# Altium project pi_clock.PrjPcb
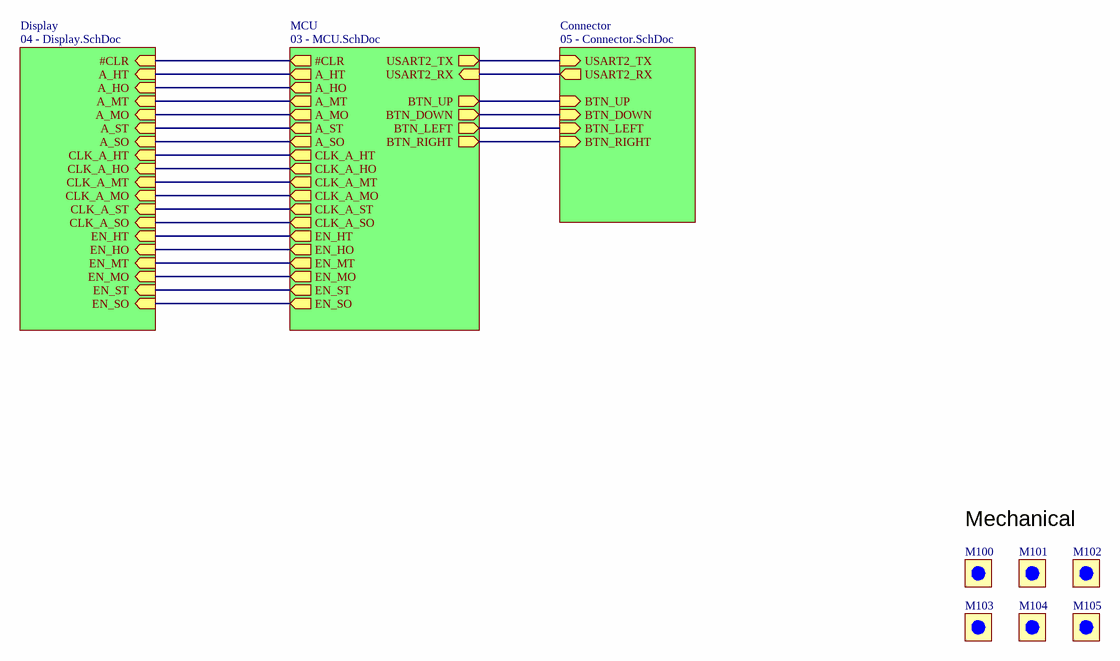
[diagram p0: 01 - Overview.SchDoc]
Reviewer: ____; ProjectState: Prototype/Release/Series; ProjectRevision: 2; ProjectNumberMiromico: UE; ProductName: ____; PCBNumberMiromico: pi_clock; PCBName: PCBName?; MFGApprovedDate: dd.mm.yyyy; DrawDate: dd.mm.yyyy; Customer: ____; CoAuthorMiromico: ____; CheckedDate: dd.mm.yyyy; CheckedByMiromico: ____; BoardRevision: B; AuthorMiromico: ____; ApprovedDate: dd.mm.yyyy
4 sheets, 125 parts. Net scope: hierarchical (ports join the sheet entries above them; power ports are global).
Board file: pi_clock.PcbDoc
Sheets:
  01 - Overview.SchDoc
    Display = 04 - Display.SchDoc
    MCU = 03 - MCU.SchDoc
    Connector = 05 - Connector.SchDoc

## Sheet 01 - Overview.SchDoc
size A4; SheetNumber: 1; SheetTotal: 4; SchemaTitle: Overview

### Parts
M100  Fiducial Round  [Fiducial round_small]  (value not drawn)  (no BOM)
M101  Fiducial Round  [Fiducial round_small]  (value not drawn)  (no BOM)
M102  Fiducial Round  [Fiducial round_small]  (value not drawn)  (no BOM)
M103  Fiducial Round  [Fiducial round_small]  (value not drawn)  (no BOM)
M104  Fiducial Round  [Fiducial round_small]  (value not drawn)  (no BOM)
M105  Fiducial Round  [Fiducial round_small]  (value not drawn)  (no BOM)

### Sub-sheets
Connector = 05 - Connector.SchDoc: USART2_RX (out), USART2_TX (in), BTN_UP (in), BTN_DOWN (in), BTN_LEFT (in), BTN_RIGHT (in)
Display = 04 - Display.SchDoc: #CLR (in), A_HT (in), A_HO (in), A_MO (in), A_SO (in), A_MT (in), A_ST (in), CLK_A_HT (in), CLK_A_HO (in), CLK_A_MT (in), CLK_A_MO (in), CLK_A_ST (in), CLK_A_SO (in), EN_HT (in), EN_HO (in), EN_MT (in), EN_MO (in), EN_ST (in), EN_SO (in)
MCU = 03 - MCU.SchDoc: #CLR (out), A_HT (out), A_HO (out), A_MT (out), A_MO (out), A_ST (out), A_SO (out), USART2_TX (out), USART2_RX (in), BTN_UP (out), BTN_DOWN (out), BTN_LEFT (out), BTN_RIGHT (out), CLK_A_HT (out), CLK_A_HO (out), CLK_A_MT (out), CLK_A_MO (out), CLK_A_ST (out), CLK_A_SO (out), EN_HT (out), EN_HO (out), EN_MT (out), EN_MO (out), EN_ST (out), EN_SO (out)

### Nets
#CLR: sheet Display/#CLR, sheet MCU/#CLR
A_HO: sheet Display/A_HO, sheet MCU/A_HO
A_HT: sheet Display/A_HT, sheet MCU/A_HT
A_MO: sheet Display/A_MO, sheet MCU/A_MO
A_MT: sheet Display/A_MT, sheet MCU/A_MT
A_SO: sheet Display/A_SO, sheet MCU/A_SO
A_ST: sheet Display/A_ST, sheet MCU/A_ST
BTN_DOWN: sheet MCU/BTN_DOWN, sheet Connector/BTN_DOWN
BTN_LEFT: sheet MCU/BTN_LEFT, sheet Connector/BTN_LEFT
BTN_RIGHT: sheet MCU/BTN_RIGHT, sheet Connector/BTN_RIGHT
BTN_UP: sheet MCU/BTN_UP, sheet Connector/BTN_UP
CLK_A_HO: sheet Display/CLK_A_HO, sheet MCU/CLK_A_HO
CLK_A_HT: sheet Display/CLK_A_HT, sheet MCU/CLK_A_HT
CLK_A_MO: sheet Display/CLK_A_MO, sheet MCU/CLK_A_MO
CLK_A_MT: sheet Display/CLK_A_MT, sheet MCU/CLK_A_MT
CLK_A_SO: sheet Display/CLK_A_SO, sheet MCU/CLK_A_SO
CLK_A_ST: sheet Display/CLK_A_ST, sheet MCU/CLK_A_ST
EN_HO: sheet Display/EN_HO, sheet MCU/EN_HO
EN_HT: sheet Display/EN_HT, sheet MCU/EN_HT
EN_MO: sheet Display/EN_MO, sheet MCU/EN_MO
EN_MT: sheet Display/EN_MT, sheet MCU/EN_MT
EN_SO: sheet Display/EN_SO, sheet MCU/EN_SO
EN_ST: sheet Display/EN_ST, sheet MCU/EN_ST
USART2_RX: sheet MCU/USART2_RX, sheet Connector/USART2_RX
USART2_TX: sheet MCU/USART2_TX, sheet Connector/USART2_TX

### Notes on the sheet
- Mechanical
- Schema Title:
- Project:
- Revision:
- Author:
- PCB Name:
- Date:
- Time:
- Sheet:
- of
- Doc Name:
- A4

### Library data of the parts
M100-M105 = Fiducial Round-11: Fiducial (Optical Marker)

## Sheet 04 - Display.SchDoc
size A4; SheetNumber: 3; SheetTotal: 4; SchemaTitle: Overview
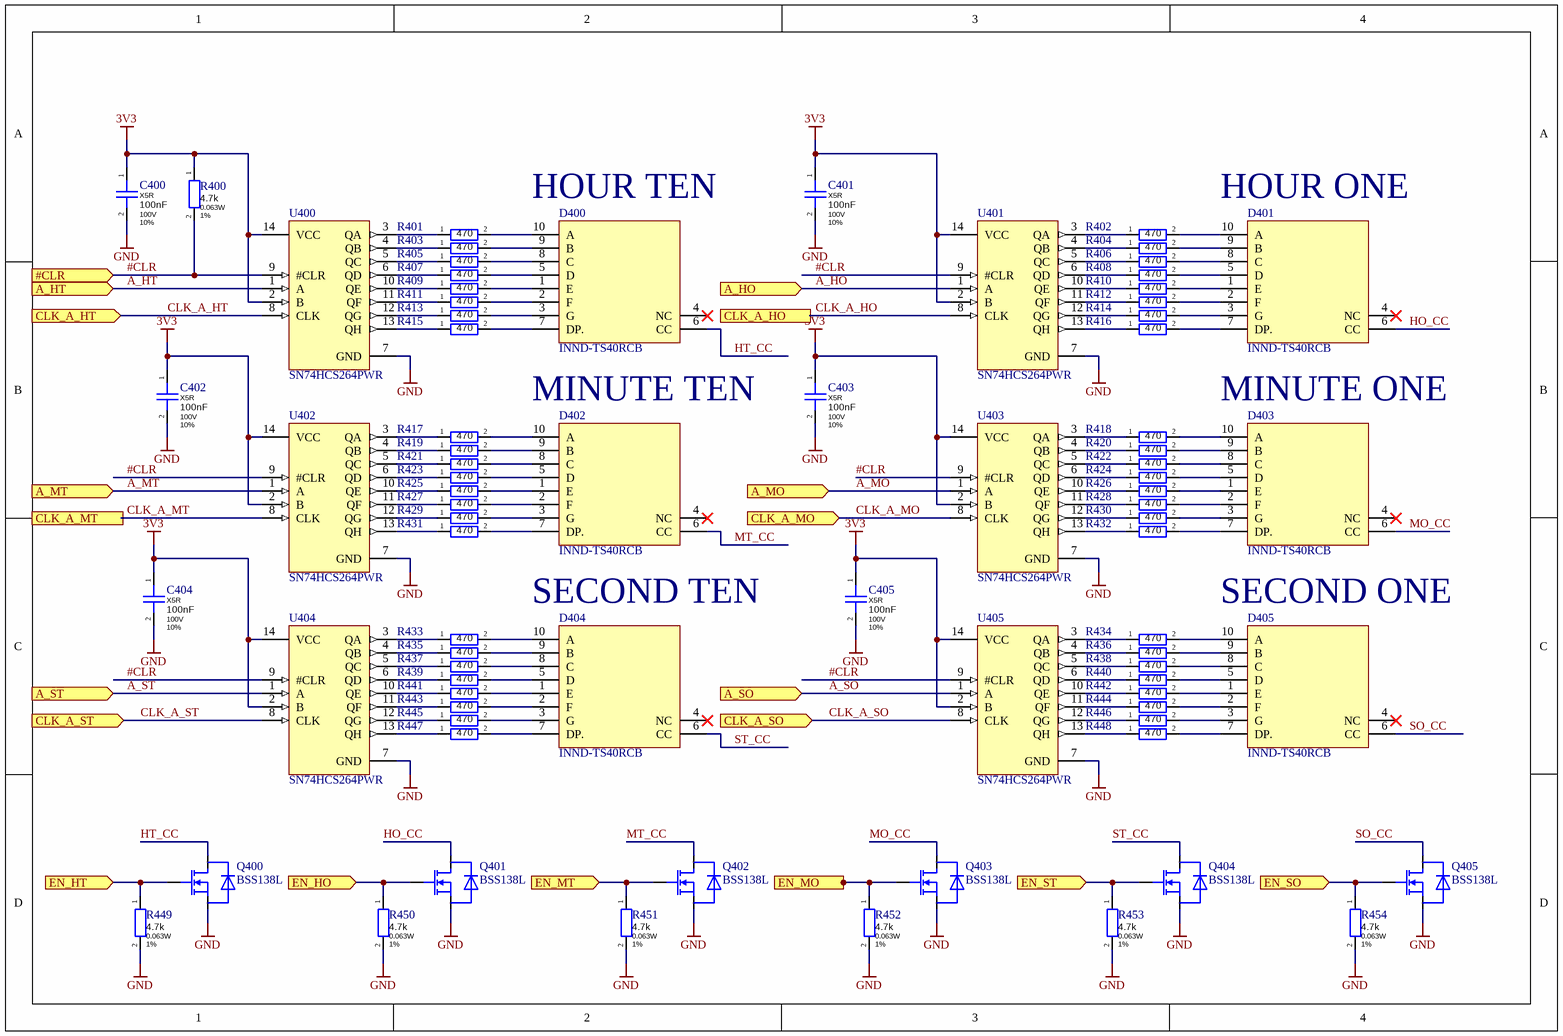
[diagram p1: 04 - Display.SchDoc]

### Parts
C400  Dielectric: X5R  Capacitance: 100nF  Voltage Rating: 100V  Tolerance: 10%  [CAPC0402(1005)60_L]  (hidden comment: GRM155R62A104KE14D)
C401  Dielectric: X5R  Capacitance: 100nF  Voltage Rating: 100V  Tolerance: 10%  [CAPC0402(1005)60_L]  (hidden comment: GRM155R62A104KE14D)
C402  Dielectric: X5R  Capacitance: 100nF  Voltage Rating: 100V  Tolerance: 10%  [CAPC0402(1005)60_L]  (hidden comment: GRM155R62A104KE14D)
C403  Dielectric: X5R  Capacitance: 100nF  Voltage Rating: 100V  Tolerance: 10%  [CAPC0402(1005)60_L]  (hidden comment: GRM155R62A104KE14D)
C404  Dielectric: X5R  Capacitance: 100nF  Voltage Rating: 100V  Tolerance: 10%  [CAPC0402(1005)60_L]  (hidden comment: GRM155R62A104KE14D)
C405  Dielectric: X5R  Capacitance: 100nF  Voltage Rating: 100V  Tolerance: 10%  [CAPC0402(1005)60_L]  (hidden comment: GRM155R62A104KE14D)
D400  INND-TS40RCB  [INND-TS40RCB-Footprint-1]
D401  INND-TS40RCB  [INND-TS40RCB-Footprint-1]
D402  INND-TS40RCB  [INND-TS40RCB-Footprint-1]
D403  INND-TS40RCB  [INND-TS40RCB-Footprint-1]
D404  INND-TS40RCB  [INND-TS40RCB-Footprint-1]
D405  INND-TS40RCB  [INND-TS40RCB-Footprint-1]
Q400  BSS138L  [SOT23-3]
Q401  BSS138L  [SOT23-3]
Q402  BSS138L  [SOT23-3]
Q403  BSS138L  [SOT23-3]
Q404  BSS138L  [SOT23-3]
Q405  BSS138L  [SOT23-3]
R400  Resistance: 4.7k  Power Rating: 0.063W  Tolerance: 1%  [RESC0402(1005)_L]  (hidden comment: RMCF0402FT4K70)
R401  Resistance: 470  [RESC0402(1005)_L]  (hidden comment: RMCF0402FT470R)
R402  Resistance: 470  [RESC0402(1005)_L]  (hidden comment: RMCF0402FT470R)
R403  Resistance: 470  [RESC0402(1005)_L]  (hidden comment: RMCF0402FT470R)
R404  Resistance: 470  [RESC0402(1005)_L]  (hidden comment: RMCF0402FT470R)
R405  Resistance: 470  [RESC0402(1005)_L]  (hidden comment: RMCF0402FT470R)
R406  Resistance: 470  [RESC0402(1005)_L]  (hidden comment: RMCF0402FT470R)
R407  Resistance: 470  [RESC0402(1005)_L]  (hidden comment: RMCF0402FT470R)
R408  Resistance: 470  [RESC0402(1005)_L]  (hidden comment: RMCF0402FT470R)
R409  Resistance: 470  [RESC0402(1005)_L]  (hidden comment: RMCF0402FT470R)
R410  Resistance: 470  [RESC0402(1005)_L]  (hidden comment: RMCF0402FT470R)
R411  Resistance: 470  [RESC0402(1005)_L]  (hidden comment: RMCF0402FT470R)
R412  Resistance: 470  [RESC0402(1005)_L]  (hidden comment: RMCF0402FT470R)
R413  Resistance: 470  [RESC0402(1005)_L]  (hidden comment: RMCF0402FT470R)
R414  Resistance: 470  [RESC0402(1005)_L]  (hidden comment: RMCF0402FT470R)
R415  Resistance: 470  [RESC0402(1005)_L]  (hidden comment: RMCF0402FT470R)
R416  Resistance: 470  [RESC0402(1005)_L]  (hidden comment: RMCF0402FT470R)
R417  Resistance: 470  [RESC0402(1005)_L]  (hidden comment: RMCF0402FT470R)
R418  Resistance: 470  [RESC0402(1005)_L]  (hidden comment: RMCF0402FT470R)
R419  Resistance: 470  [RESC0402(1005)_L]  (hidden comment: RMCF0402FT470R)
R420  Resistance: 470  [RESC0402(1005)_L]  (hidden comment: RMCF0402FT470R)
R421  Resistance: 470  [RESC0402(1005)_L]  (hidden comment: RMCF0402FT470R)
R422  Resistance: 470  [RESC0402(1005)_L]  (hidden comment: RMCF0402FT470R)
R423  Resistance: 470  [RESC0402(1005)_L]  (hidden comment: RMCF0402FT470R)
R424  Resistance: 470  [RESC0402(1005)_L]  (hidden comment: RMCF0402FT470R)
R425  Resistance: 470  [RESC0402(1005)_L]  (hidden comment: RMCF0402FT470R)
R426  Resistance: 470  [RESC0402(1005)_L]  (hidden comment: RMCF0402FT470R)
R427  Resistance: 470  [RESC0402(1005)_L]  (hidden comment: RMCF0402FT470R)
R428  Resistance: 470  [RESC0402(1005)_L]  (hidden comment: RMCF0402FT470R)
R429  Resistance: 470  [RESC0402(1005)_L]  (hidden comment: RMCF0402FT470R)
R430  Resistance: 470  [RESC0402(1005)_L]  (hidden comment: RMCF0402FT470R)
R431  Resistance: 470  [RESC0402(1005)_L]  (hidden comment: RMCF0402FT470R)
R432  Resistance: 470  [RESC0402(1005)_L]  (hidden comment: RMCF0402FT470R)
R433  Resistance: 470  [RESC0402(1005)_L]  (hidden comment: RMCF0402FT470R)
R434  Resistance: 470  [RESC0402(1005)_L]  (hidden comment: RMCF0402FT470R)
R435  Resistance: 470  [RESC0402(1005)_L]  (hidden comment: RMCF0402FT470R)
R436  Resistance: 470  [RESC0402(1005)_L]  (hidden comment: RMCF0402FT470R)
R437  Resistance: 470  [RESC0402(1005)_L]  (hidden comment: RMCF0402FT470R)
R438  Resistance: 470  [RESC0402(1005)_L]  (hidden comment: RMCF0402FT470R)
R439  Resistance: 470  [RESC0402(1005)_L]  (hidden comment: RMCF0402FT470R)
R440  Resistance: 470  [RESC0402(1005)_L]  (hidden comment: RMCF0402FT470R)
R441  Resistance: 470  [RESC0402(1005)_L]  (hidden comment: RMCF0402FT470R)
R442  Resistance: 470  [RESC0402(1005)_L]  (hidden comment: RMCF0402FT470R)
R443  Resistance: 470  [RESC0402(1005)_L]  (hidden comment: RMCF0402FT470R)
R444  Resistance: 470  [RESC0402(1005)_L]  (hidden comment: RMCF0402FT470R)
R445  Resistance: 470  [RESC0402(1005)_L]  (hidden comment: RMCF0402FT470R)
R446  Resistance: 470  [RESC0402(1005)_L]  (hidden comment: RMCF0402FT470R)
R447  Resistance: 470  [RESC0402(1005)_L]  (hidden comment: RMCF0402FT470R)
R448  Resistance: 470  [RESC0402(1005)_L]  (hidden comment: RMCF0402FT470R)
R449  Resistance: 4.7k  Power Rating: 0.063W  Tolerance: 1%  [RESC0402(1005)_L]  (hidden comment: RMCF0402FT4K70)
R450  Resistance: 4.7k  Power Rating: 0.063W  Tolerance: 1%  [RESC0402(1005)_L]  (hidden comment: RMCF0402FT4K70)
R451  Resistance: 4.7k  Power Rating: 0.063W  Tolerance: 1%  [RESC0402(1005)_L]  (hidden comment: RMCF0402FT4K70)
R452  Resistance: 4.7k  Power Rating: 0.063W  Tolerance: 1%  [RESC0402(1005)_L]  (hidden comment: RMCF0402FT4K70)
R453  Resistance: 4.7k  Power Rating: 0.063W  Tolerance: 1%  [RESC0402(1005)_L]  (hidden comment: RMCF0402FT4K70)
R454  Resistance: 4.7k  Power Rating: 0.063W  Tolerance: 1%  [RESC0402(1005)_L]  (hidden comment: RMCF0402FT4K70)
U400  SN74HCS264PWR  [TSSOP-14]
U401  SN74HCS264PWR  [TSSOP-14]
U402  SN74HCS264PWR  [TSSOP-14]
U403  SN74HCS264PWR  [TSSOP-14]
U404  SN74HCS264PWR  [TSSOP-14]
U405  SN74HCS264PWR  [TSSOP-14]

### Ports
#CLR (in), A_HO (in), A_HT (in), A_MO (in), A_MT (in), A_SO (in), A_ST (in), CLK_A_HO (in), CLK_A_HT (in), CLK_A_MO (in), CLK_A_MT (in), CLK_A_SO (in), CLK_A_ST (in), EN_HO (in), EN_HT (in), EN_MO (in), EN_MT (in), EN_SO (in), EN_ST (in)

### Nets
3V3: C400.1 C401.1 C402.1 C403.1 C404.1 C405.1 R400.1 U400.2(B) U400.14(VCC) U401.2(B) U401.14(VCC) U402.2(B) U402.14(VCC) U403.2(B) U403.14(VCC) U404.2(B) U404.14(VCC) U405.2(B) U405.14(VCC)
GND: C400.2 C401.2 C402.2 C403.2 C404.2 C405.2 Q400.2(S) Q401.2(S) Q402.2(S) Q403.2(S) Q404.2(S) Q405.2(S) R449.2 R450.2 R451.2 R452.2 R453.2 R454.2 U400.7(GND) U401.7(GND) U402.7(GND) U403.7(GND) U404.7(GND) U405.7(GND)
#CLR: R400.2 U400.9(#CLR) U401.9(#CLR) U402.9(#CLR) U403.9(#CLR) U404.9(#CLR) U405.9(#CLR) ; port #CLR
A_HO: U401.1(A) ; port A_HO
A_HT: U400.1(A) ; port A_HT
A_MO: U403.1(A) ; port A_MO
A_MT: U402.1(A) ; port A_MT
A_SO: U405.1(A) ; port A_SO
A_ST: U404.1(A) ; port A_ST
CLK_A_HO: U401.8(CLK) ; port CLK_A_HO
CLK_A_HT: U400.8(CLK) ; port CLK_A_HT
CLK_A_MO: U403.8(CLK) ; port CLK_A_MO
CLK_A_MT: U402.8(CLK) ; port CLK_A_MT
CLK_A_SO: U405.8(CLK) ; port CLK_A_SO
CLK_A_ST: U404.8(CLK) ; port CLK_A_ST
EN_HO: Q401.1(G) R450.1 ; port EN_HO
EN_HT: Q400.1(G) R449.1 ; port EN_HT
EN_MO: Q403.1(G) R452.1 ; port EN_MO
EN_MT: Q402.1(G) R451.1 ; port EN_MT
EN_SO: Q405.1(G) R454.1 ; port EN_SO
EN_ST: Q404.1(G) R453.1 ; port EN_ST
HO_CC: D401.6(CC) Q401.3(D)
HT_CC: D400.6(CC) Q400.3(D)
MO_CC: D403.6(CC) Q403.3(D)
MT_CC: D402.6(CC) Q402.3(D)
SO_CC: D405.6(CC) Q405.3(D)
ST_CC: D404.6(CC) Q404.3(D)
NetD400_1: D400.1(E) R409.2
NetD400_2: D400.2(F) R411.2
NetD400_3: D400.3(G) R413.2
NetD400_5: D400.5(D) R407.2
NetD400_7: D400.7(DP.) R415.2
NetD400_8: D400.8(C) R405.2
NetD400_9: D400.9(B) R403.2
NetD400_10: D400.10(A) R401.2
NetD401_1: D401.1(E) R410.2
NetD401_2: D401.2(F) R412.2
NetD401_3: D401.3(G) R414.2
NetD401_5: D401.5(D) R408.2
NetD401_7: D401.7(DP.) R416.2
NetD401_8: D401.8(C) R406.2
NetD401_9: D401.9(B) R404.2
NetD401_10: D401.10(A) R402.2
NetD402_1: D402.1(E) R425.2
NetD402_2: D402.2(F) R427.2
NetD402_3: D402.3(G) R429.2
NetD402_5: D402.5(D) R423.2
NetD402_7: D402.7(DP.) R431.2
NetD402_8: D402.8(C) R421.2
NetD402_9: D402.9(B) R419.2
NetD402_10: D402.10(A) R417.2
NetD403_1: D403.1(E) R426.2
NetD403_2: D403.2(F) R428.2
NetD403_3: D403.3(G) R430.2
NetD403_5: D403.5(D) R424.2
NetD403_7: D403.7(DP.) R432.2
NetD403_8: D403.8(C) R422.2
NetD403_9: D403.9(B) R420.2
NetD403_10: D403.10(A) R418.2
NetD404_1: D404.1(E) R441.2
NetD404_2: D404.2(F) R443.2
NetD404_3: D404.3(G) R445.2
NetD404_5: D404.5(D) R439.2
NetD404_7: D404.7(DP.) R447.2
NetD404_8: D404.8(C) R437.2
NetD404_9: D404.9(B) R435.2
NetD404_10: D404.10(A) R433.2
NetD405_1: D405.1(E) R442.2
NetD405_2: D405.2(F) R444.2
NetD405_3: D405.3(G) R446.2
NetD405_5: D405.5(D) R440.2
NetD405_7: D405.7(DP.) R448.2
NetD405_8: D405.8(C) R438.2
NetD405_9: D405.9(B) R436.2
NetD405_10: D405.10(A) R434.2
NetR401_1: R401.1 U400.3(QA)
NetR402_1: R402.1 U401.3(QA)
NetR403_1: R403.1 U400.4(QB)
NetR404_1: R404.1 U401.4(QB)
NetR405_1: R405.1 U400.5(QC)
NetR406_1: R406.1 U401.5(QC)
NetR407_1: R407.1 U400.6(QD)
NetR408_1: R408.1 U401.6(QD)
NetR409_1: R409.1 U400.10(QE)
NetR410_1: R410.1 U401.10(QE)
NetR411_1: R411.1 U400.11(QF)
NetR412_1: R412.1 U401.11(QF)
NetR413_1: R413.1 U400.12(QG)
NetR414_1: R414.1 U401.12(QG)
NetR415_1: R415.1 U400.13(QH)
NetR416_1: R416.1 U401.13(QH)
NetR417_1: R417.1 U402.3(QA)
NetR418_1: R418.1 U403.3(QA)
NetR419_1: R419.1 U402.4(QB)
NetR420_1: R420.1 U403.4(QB)
NetR421_1: R421.1 U402.5(QC)
NetR422_1: R422.1 U403.5(QC)
NetR423_1: R423.1 U402.6(QD)
NetR424_1: R424.1 U403.6(QD)
NetR425_1: R425.1 U402.10(QE)
NetR426_1: R426.1 U403.10(QE)
NetR427_1: R427.1 U402.11(QF)
NetR428_1: R428.1 U403.11(QF)
NetR429_1: R429.1 U402.12(QG)
NetR430_1: R430.1 U403.12(QG)
NetR431_1: R431.1 U402.13(QH)
NetR432_1: R432.1 U403.13(QH)
NetR433_1: R433.1 U404.3(QA)
NetR434_1: R434.1 U405.3(QA)
NetR435_1: R435.1 U404.4(QB)
NetR436_1: R436.1 U405.4(QB)
NetR437_1: R437.1 U404.5(QC)
NetR438_1: R438.1 U405.5(QC)
NetR439_1: R439.1 U404.6(QD)
NetR440_1: R440.1 U405.6(QD)
NetR441_1: R441.1 U404.10(QE)
NetR442_1: R442.1 U405.10(QE)
NetR443_1: R443.1 U404.11(QF)
NetR444_1: R444.1 U405.11(QF)
NetR445_1: R445.1 U404.12(QG)
NetR446_1: R446.1 U405.12(QG)
NetR447_1: R447.1 U404.13(QH)
NetR448_1: R448.1 U405.13(QH)

Not connected (* = marked no-connect by the designer): D400 4(NC)*; D401 4(NC)*; D402 4(NC)*; D403 4(NC)*; D404 4(NC)*; D405 4(NC)*

### Notes on the sheet
- (near D400) HOUR TEN
- (near D401) HOUR ONE
- MINUTE TEN
- MINUTE ONE
- SECOND TEN
- SECOND ONE
- Schema Title:
- Project:
- Revision:
- Author:
- PCB Name:
- Date:
- Time:
- Sheet:
- of
- Doc Name:
- A4

### Library data of the parts
C400-C405 = CMP-00636-01: 0.1µF ±10% 100V Ceramic Capacitor X5R 0402 (1005 Metric); Manufacturer: Murata Electronics; RoHS Compliant: Yes; Mount: Surface Mount; Max Operating Temperature: 85°C; Min Operating Temperature: -55°C; Supplier Part Number 1: 490-10458-1-ND; Case/Package: 0402; Length: 0.039inch; Manufacturer Part Number: GRM155R62A104KE14D; Termination: SMD/SMT; Thickness: 0.022inch; ComponentLink1Description: Datasheet; Packaging: Tape and Reel; Height: 0.5mm; Package Quantity: 10000; Supplier 1: Digi-Key; Case Code (Imperial): 0402; Lead Free: Lead Free; Case Code (Metric): 1005; Voltage Rating (DC): 100V; Width: 0.5mm; Weight: 0.000212oz; REACH SVHC: No SVHC
D400-D405 = CMP-02011-01: Display Modules - LED Character and Numeric Red 7-Segment 1 Character Common Cathode 2V 20mA 0.508" H x 0.379" W x 0.250" D (12.90mm x 9.63mm x 6.36mm) 10-DIP (0.300", 7.62mm); Manufacturer: Inolux; ComponentLink1URL: https://www.inolux-corp.com/datasheet/Display/Through-Hole-Display/SingleDigit/INND-TS40%20Series_V1.0.pdf; Supplier Part Number 1: 1830-1155-ND; Supplier 1: Digi-Key; Manufacturer Part Number: INND-TS40RCB; ComponentLink1Description: Datasheet
Q400-Q405 = CMP-00239-05: MOSFET N-CH 50V 200MA SOT-23; Manufacturer: ON Semiconductor; Turn-On Delay Time: 2.2ns; Input Capacitance: 50pF; Max Power Dissipation: 350mW; Gate to Source Voltage (Vgs): 20V; Fall Time: 5.1ns; Rise Time: 1.8ns; Drain to Source Resistance: 3.5R; Element Configuration: Single; Number of Channels: 1; Turn-Off Delay Time: 5.3ns; Threshold Voltage: 1.25V; Drain to Source Breakdown Voltage: 50V; Package Quantity: 3000; Manufacturer Part Number: BSS138L; ComponentLink1URL: https://www.onsemi.com/pdf/datasheet/bss138l-d.pdf; Min Operating Temperature: -55°C; Continuous Drain Current (ID): 200mA; Supplier Part Number 1: BSS138LCT-ND; ComponentLink1Description: Datasheet; Weight: 0.03g; Supplier 1: Digikey; REACH SVHC: No SVHC; Case/Package: SOT-23-3; Drain to Source Voltage (Vdss): 50V; Packaging: Tape and Reel; Rds On Max: 3.5R; Max Operating Temperature: 150°C; Mount: Surface Mount; Number of Pins: 3
R400 R449-R454 = CMP-00490-01: 4.7 kOhms ±1% 0.063W, 1/16W Chip Resistor 0402 (1005 Metric) Automotive AEC-Q200 Thick Film; Manufacturer: Stackpole Electronics Inc; Max Power Dissipation: 63mW; Temperature Coefficient: 100ppm/°C; Case Code (Metric): 1005; Case Code (Imperial): 0402; Min Operating Temperature: -55°C; Supplier Part Number 1: RMCF0402FT4K70CT-ND; Radiation Hardening: No; Width: 0.02inch; Depth: 0.5mm; Supplier 1: Digi-Key; Case/Package: 0402; Length: 1mm; Lead Free: Lead Free; Height: 0.016inch; Max Operating Temperature: 155°C; Features: Automotive AEC-Q200; Number of Terminations: 2; Resistor Type: Thick Film; Contact Plating: Tin,Matte; Military Standard: Not; Manufacturer Part Number: RMCF0402FT4K70; Mount: Surface Mount; Packaging: Tape and Reel; ComponentLink1Description: Datasheet
R401-R448 = CMP-00454-01: 470 Ohms ±1% 0.063W, 1/16W Chip Resistor 0402 (1005 Metric) Automotive AEC-Q200 Thick Film; Manufacturer: Stackpole Electronics Inc; Power Rating: 63mW; Temperature Coefficient: 100ppm/°C; Tolerance: 1%; Resistor Type: Thick Film; Packaging: Tape and Reel; Max Operating Temperature: 155°C; Height: 0.016inch; Manufacturer Part Number: RMCF0402FT470R; Radiation Hardening: No; Number of Terminations: 2; Contact Plating: Tin,Matte; Case Code (Metric): 1005; Case/Package: 0402; ComponentLink1Description: Datasheet; Supplier Part Number 1: 738-RMCF0402FT470RCT-ND; Supplier 1: Digi-Key; Length: 0.039inch; Mount: Surface Mount; Case Code (Imperial): 0402; Features: Automotive AEC-Q200; Width: 0.02inch; Max Power Dissipation: 63mW; Min Operating Temperature: -55°C
U400-U405 = CMP-02018-01: Shift Shift Register 1 Element 8 Bit 14-TSSOP; Manufacturer: Texas Instruments; ComponentLink1Description: Datasheet; Supplier 1: Digi-Key; Supplier Part Number 1: 296-SN74HCS264PWRCT-ND; ComponentLink1URL: https://www.ti.com/lit/ds/symlink/sn74hcs264.pdf; Manufacturer Part Number: SN74HCS264PWR

## Sheet 03 - MCU.SchDoc
size A4; SheetNumber: 2; SheetTotal: 4; SchemaTitle: Overview
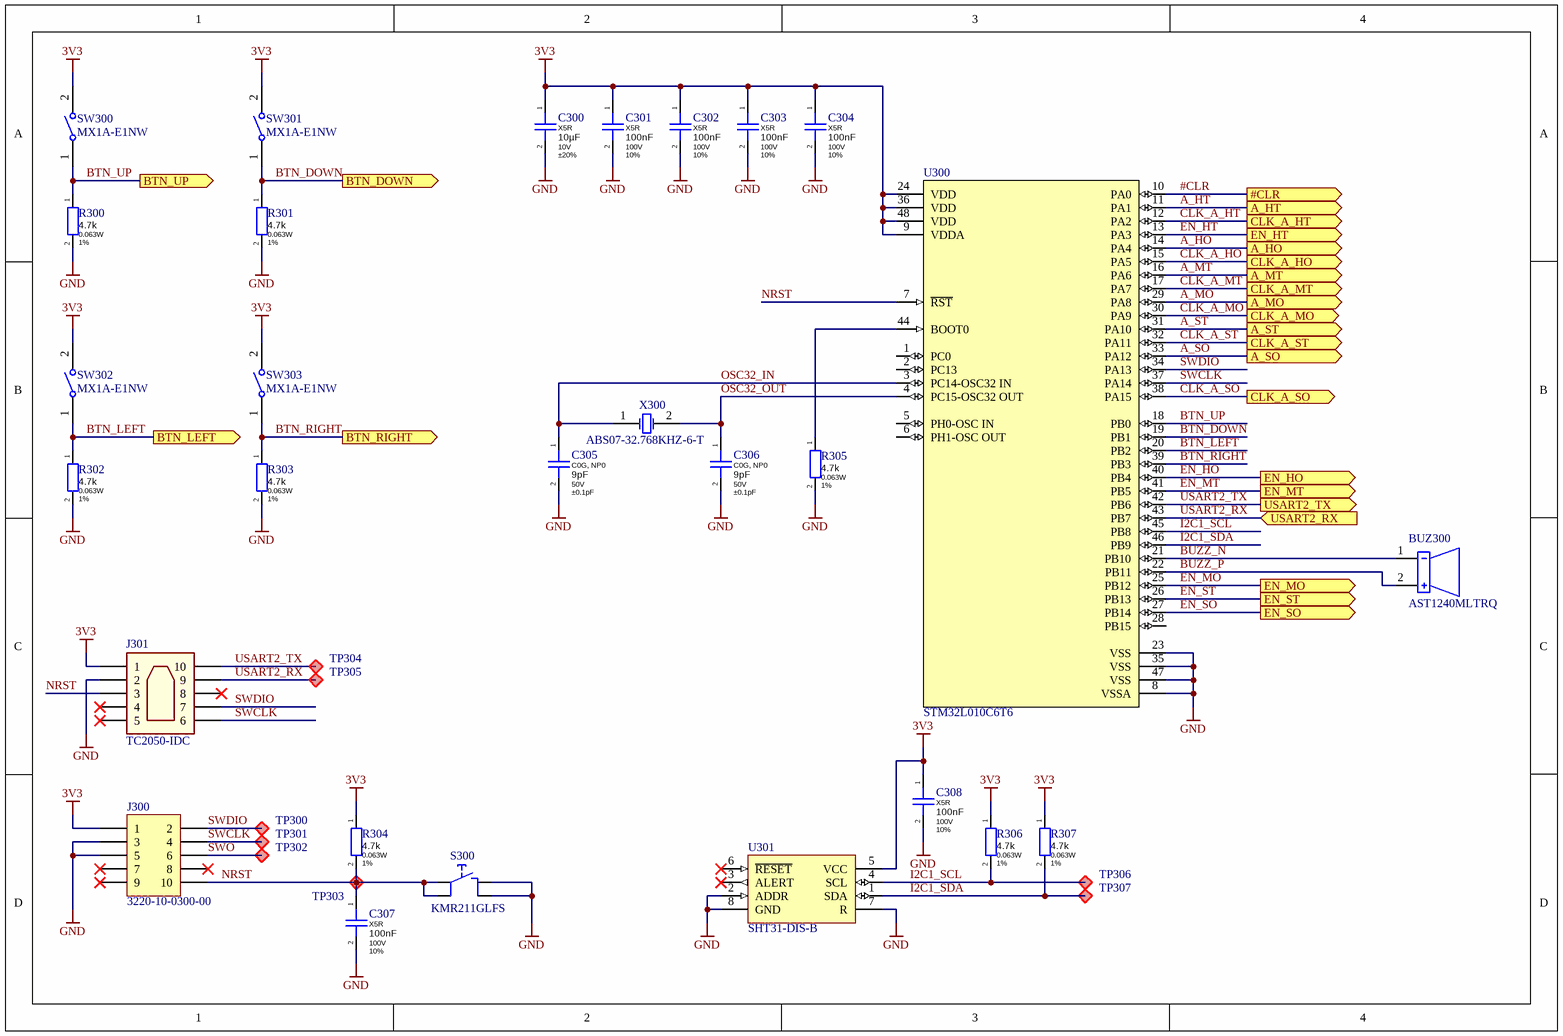
[diagram p2: 03 - MCU.SchDoc]

### Parts
BUZ300  AST1240MLTRQ  [AST1240MLTRQ]
C300  Dielectric: X5R  Capacitance: 10µF  Voltage Rating: 10V  Tolerance: ±20%  [CAPC0402(1005)60_L]  (hidden comment: CL05A106MP8NUB8)
C301  Dielectric: X5R  Capacitance: 100nF  Voltage Rating: 100V  Tolerance: 10%  [CAPC0402(1005)60_L]  (hidden comment: GRM155R62A104KE14D)
C302  Dielectric: X5R  Capacitance: 100nF  Voltage Rating: 100V  Tolerance: 10%  [CAPC0402(1005)60_L]  (hidden comment: GRM155R62A104KE14D)
C303  Dielectric: X5R  Capacitance: 100nF  Voltage Rating: 100V  Tolerance: 10%  [CAPC0402(1005)60_L]  (hidden comment: GRM155R62A104KE14D)
C304  Dielectric: X5R  Capacitance: 100nF  Voltage Rating: 100V  Tolerance: 10%  [CAPC0402(1005)60_L]  (hidden comment: GRM155R62A104KE14D)
C305  Dielectric: C0G, NP0  Capacitance: 9pF  Voltage Rating: 50V  Tolerance: ±0.1pF  [CAPC0402(1005)60_L]  (hidden comment: CC0402BRNPO9BN9R0)
C306  Dielectric: C0G, NP0  Capacitance: 9pF  Voltage Rating: 50V  Tolerance: ±0.1pF  [CAPC0402(1005)60_L]  (hidden comment: CC0402BRNPO9BN9R0)
C307  Dielectric: X5R  Capacitance: 100nF  Voltage Rating: 100V  Tolerance: 10%  [CAPC0402(1005)60_L]  (hidden comment: GRM155R62A104KE14D)
C308  Dielectric: X5R  Capacitance: 100nF  Voltage Rating: 100V  Tolerance: 10%  [CAPC0402(1005)60_L]  (hidden comment: GRM155R62A104KE14D)
J300  3220-10-0300-00  [3220-10-0300-00-Footprint-1]
J301  TC2050-IDC  [TC2050-IDC]  (no BOM)
R300  Resistance: 4.7k  Power Rating: 0.063W  Tolerance: 1%  [RESC0402(1005)_L]  (hidden comment: RMCF0402FT4K70)
R301  Resistance: 4.7k  Power Rating: 0.063W  Tolerance: 1%  [RESC0402(1005)_L]  (hidden comment: RMCF0402FT4K70)
R302  Resistance: 4.7k  Power Rating: 0.063W  Tolerance: 1%  [RESC0402(1005)_L]  (hidden comment: RMCF0402FT4K70)
R303  Resistance: 4.7k  Power Rating: 0.063W  Tolerance: 1%  [RESC0402(1005)_L]  (hidden comment: RMCF0402FT4K70)
R304  Resistance: 4.7k  Power Rating: 0.063W  Tolerance: 1%  [RESC0402(1005)_L]  (hidden comment: RMCF0402FT4K70)
R305  Resistance: 4.7k  Power Rating: 0.063W  Tolerance: 1%  [RESC0402(1005)_L]  (hidden comment: RMCF0402FT4K70)
R306  Resistance: 4.7k  Power Rating: 0.063W  Tolerance: 1%  [RESC0402(1005)_L]  (hidden comment: RMCF0402FT4K70)
R307  Resistance: 4.7k  Power Rating: 0.063W  Tolerance: 1%  [RESC0402(1005)_L]  (hidden comment: RMCF0402FT4K70)
S300  KMR211GLFS  [KMR211GLFS]
SW300  MX1A-E1NW  [MX1A-E1NW-Footprint-1]
SW301  MX1A-E1NW  [MX1A-E1NW-Footprint-1]
SW302  MX1A-E1NW  [MX1A-E1NW-Footprint-1]
SW303  MX1A-E1NW  [MX1A-E1NW-Footprint-1]
TP300  Testpoint  [Testpoint SMD 1.5mm]  (value not drawn)  (no BOM)
TP301  Testpoint  [Testpoint SMD 1.5mm]  (value not drawn)  (no BOM)
TP302  Testpoint  [Testpoint SMD 1.5mm]  (value not drawn)  (no BOM)
TP303  Testpoint  [Testpoint SMD 1.5mm]  (value not drawn)  (no BOM)
TP304  Testpoint  [Testpoint SMD 1.5mm]  (value not drawn)  (no BOM)
TP305  Testpoint  [Testpoint SMD 1.5mm]  (value not drawn)  (no BOM)
TP306  Testpoint  [Testpoint SMD 1.5mm]  (value not drawn)  (no BOM)
TP307  Testpoint  [Testpoint SMD 1.5mm]  (value not drawn)  (no BOM)
U300  STM32L010C6T6  [LQFP-48 (LQ)]
U301  SHT31-DIS-B  [8  -  Pin DFN 2.5  x  2.5  mm x 0.9 mm]
X300  ABS07-32.768KHZ-6-T  [ABRA-ABS07_V]

### Ports
#CLR (out), A_HO (out), A_HT (out), A_MO (out), A_MT (out), A_SO (out), A_ST (out), BTN_DOWN (out), BTN_LEFT (out), BTN_RIGHT (out), BTN_UP (out), CLK_A_HO (out), CLK_A_HT (out), CLK_A_MO (out), CLK_A_MT (out), CLK_A_SO (out), CLK_A_ST (out), EN_HO (out), EN_HT (out), EN_MO (out), EN_MT (out), EN_SO (out), EN_ST (out), USART2_RX (in), USART2_TX (out)

### Nets
3V3: C300.1 C301.1 C302.1 C303.1 C304.1 C308.1 J300.1 J301.1 R304.1 R306.1 R307.1 SW300.2 SW301.2 SW302.2 SW303.2 U300.9(VDDA) U300.24(VDD) U300.36(VDD) U300.48(VDD) U301.5(VCC)
GND: C300.2 C301.2 C302.2 C303.2 C304.2 C305.2 C306.2 C307.2 C308.2 J300.3 J300.5 J301.2 R300.2 R301.2 R302.2 R303.2 R305.2 S300.3 S300.4 U300.8(VSSA) U300.23(VSS) U300.35(VSS) U300.47(VSS) U301.2(ADDR) U301.7(R) U301.8(GND)
#CLR: U300.10(PA0) ; port #CLR
A_HO: U300.14(PA4) ; port A_HO
A_HT: U300.11(PA1) ; port A_HT
A_MO: U300.29(PA8) ; port A_MO
A_MT: U300.16(PA6) ; port A_MT
A_SO: U300.33(PA12) ; port A_SO
A_ST: U300.31(PA10) ; port A_ST
BTN_DOWN: R301.1 SW301.1 U300.19(PB1) ; port BTN_DOWN
BTN_LEFT: R302.1 SW302.1 U300.20(PB2) ; port BTN_LEFT
BTN_RIGHT: R303.1 SW303.1 U300.39(PB3) ; port BTN_RIGHT
BTN_UP: R300.1 SW300.1 U300.18(PB0) ; port BTN_UP
BUZZ_N: BUZ300.1(DAT3) U300.21(PB10)
BUZZ_P: BUZ300.2(DAT2) U300.22(PB11)
CLK_A_HO: U300.15(PA5) ; port CLK_A_HO
CLK_A_HT: U300.12(PA2) ; port CLK_A_HT
CLK_A_MO: U300.30(PA9) ; port CLK_A_MO
CLK_A_MT: U300.17(PA7) ; port CLK_A_MT
CLK_A_SO: U300.38(PA15) ; port CLK_A_SO
CLK_A_ST: U300.32(PA11) ; port CLK_A_ST
EN_HO: U300.40(PB4) ; port EN_HO
EN_HT: U300.13(PA3) ; port EN_HT
EN_MO: U300.25(PB12) ; port EN_MO
EN_MT: U300.41(PB5) ; port EN_MT
EN_SO: U300.27(PB14) ; port EN_SO
EN_ST: U300.26(PB13) ; port EN_ST
I2C1_SCL: R306.2 TP306.1 U300.45(PB8) U301.4(SCL)
I2C1_SDA: R307.2 TP307.1 U300.46(PB9) U301.1(SDA)
NRST: C307.1 J300.10 J301.3 R304.2 S300.1 S300.2 TP303.1 U300.7(~{RST})
OSC32_IN: C305.1 U300.3(PC14-OSC32_IN) X300.1(X1)
OSC32_OUT: C306.1 U300.4(PC15-OSC32_OUT) X300.2(X2)
SWCLK: J300.4 J301.6 TP301.1 U300.37(PA14)
SWDIO: J300.2 J301.7 TP300.1 U300.34(PA13)
SWO: J300.6 TP302.1
USART2_RX: J301.9 TP305.1 U300.43(PB7) ; port USART2_RX
USART2_TX: J301.10 TP304.1 U300.42(PB6) ; port USART2_TX
NetR305_1: R305.1 U300.44(BOOT0)

Not connected (* = marked no-connect by the designer): J300 7* 8* 9*; J301 4* 5* 8*; U300 1(PC0) 2(PC13) 5(PH0-OSC_IN) 6(PH1-OSC_OUT) 28(PB15); U301 3(ALERT)* 6(~{RESET})*

### Notes on the sheet
- Schema Title:
- Project:
- Revision:
- Author:
- PCB Name:
- Date:
- Time:
- Sheet:
- of
- Doc Name:
- A4

### Library data of the parts
BUZ300 = CMP-00050-02: Buzzers Transducer, Externally Driven Piezo 3V 5mA 4kHz 75dB @ 3V, 10cm Surface Mount Solder Pads; Manufacturer: Mallory Sonalert Products Inc.; Max Supply Voltage: 25V; Min Supply Voltage: 1V; REACH SVHC: Unknown; Supplier Part Number 1: 458-1094-1-ND; Width: 12mm; Manufacturer Part Number: AST1240MLTRQ; Frequency: 4kHz; Termination: Solder; Packaging: Tape and Reel; Supplier 1: DigiKey; Max Operating Temperature: 70°C; Case/Package: SMD/SMT; Color: Black; Self Resonant Frequency: 4kHz; Mount: Surface Mount; Min Operating Temperature: -20°C; ComponentLink1Description: Datasheet; Height: 3.3mm; ComponentLink1URL: https://www.mspindy.com/specifications/AST1240MLTRQ.pdf; Length: 12mm; Current Rating: 5mA; Operating Supply Current: 5mA; Voltage Rating: 3V
C300 = CMP-00826-01: 10µF ±20% 10V Ceramic Capacitor X5R 0402 (1005 Metric); Manufacturer: Samsung Electro-Mechanics; Supplier 1: Digi-Key; ComponentLink1Description: Datasheet; Supplier Part Number 1: 1276-6830-1-ND; Manufacturer Part Number: CL05A106MP8NUB8
C301-C304 C307 C308 = CMP-00636-01: as C400 on sheet 04 - Display; RoHS Compliant: Yes; Mount: Surface Mount; Max Operating Temperature: 85°C; Min Operating Temperature: -55°C; Supplier Part Number 1: 490-10458-1-ND; Case/Package: 0402; Length: 0.039inch; Manufacturer Part Number: GRM155R62A104KE14D; Termination: SMD/SMT; Thickness: 0.022inch; ComponentLink1Description: Datasheet; Packaging: Tape and Reel; Height: 0.5mm; Package Quantity: 10000; Supplier 1: Digi-Key; Case Code (Imperial): 0402; Lead Free: Lead Free; Case Code (Metric): 1005; Voltage Rating (DC): 100V; Width: 0.5mm; Weight: 0.000212oz; REACH SVHC: No SVHC
C305 C306 = CMP-00880-01: 9pF ±0.1pF 50V Ceramic Capacitor C0G, NP0 0402 (1005 Metric); Manufacturer: Yageo; ComponentLink1Description: Datasheet; ComponentLink1URL: https://www.yageo.com/upload/media/product/productsearch/datasheet/mlcc/UPY-GP_NP0_16V-to-50V_18.pdf; Supplier 1: Digi-Key; Manufacturer Part Number: CC0402BRNPO9BN9R0; Datasheet: https://www.yageo.com/upload/media/product/productsearch/datasheet/mlcc/UPY-GP_NP0_16V-to-50V_18.pdf; Supplier Part Number 1: 311-1629-1-ND
J300 = CMP-01468-03: Connector Header Surface Mount 10 position 0.050" (1.27mm); Manufacturer: CNC Tech; ComponentLink1Description: Datasheet; Datasheet: https://www.cnctech.us/pdfs/3220-XX-0300-00_.pdf; Supplier Part Number 1: 1175-1629-ND; Supplier 1: Digi-Key; Manufacturer Part Number: 3220-10-0300-00; ComponentLink1URL: https://www.cnctech.us/pdfs/3220-XX-0300-00_.pdf
J301 = TDC2050-IDC-06: TDC2050-IDC, 10Pins, dual footprint (leg and no-legs); Manufacturer: Tag-Connect; Manufacturer Part Number: TC2050-IDC; Supplier Part Number 1: TC2050-IDC; ComponentLink1Description: Datasheet; SchLibComponentName: TC2050-IDC; Supplier 1: Tag-Connect; ComponentLink1URL: http://www.tag-connect.com/Materials/TC2050-IDC%20Datasheet.pdf
R300-R307 = CMP-00490-01: as R400 on sheet 04 - Display; Case Code (Metric): 1005; Case Code (Imperial): 0402; Min Operating Temperature: -55°C; Supplier Part Number 1: RMCF0402FT4K70CT-ND; Radiation Hardening: No; Width: 0.02inch; Depth: 0.5mm; Supplier 1: Digi-Key; Case/Package: 0402; Length: 1mm; Lead Free: Lead Free; Height: 0.016inch; Max Operating Temperature: 155°C; Features: Automotive AEC-Q200; Number of Terminations: 2; Resistor Type: Thick Film; Contact Plating: Tin,Matte; Military Standard: Not; Manufacturer Part Number: RMCF0402FT4K70; Mount: Surface Mount; Packaging: Tape and Reel; ComponentLink1Description: Datasheet
S300 = KMR211GLFS-02: SWITCH TACTILE SPST-NO 0.05A 32V; Manufacturer: C&K Components; Actuator Orientation: Top Actuated; Outline: 4.60mm x 2.80mm; Contact Rating @ Voltage: 0.05A @ 32VDC; Actuator Type: Standard; Operating Force: 120gf; Switch Function: Off-Mom; Illumination: Non-Illuminated; Actuator Height off PCB, from Pins: 1.90mm; Switch Travel: 0.20mm; Mechanical Life: 200,000 Cycles; Manufacturer Part Number: KMR211GLFS; ComponentLink1Description: Datasheet; Supplier Part Number 1: 401-1426-1-ND; Mounting Type: Surface Mount; Circuit: SPST-NO; Termination Style: Gull Wing; Illumination Type, Color: -; RoHS: RoHS Compliant; Stock 1: 31963; Category: Switches; Actuator Material: -; Supplier 1: Digi-Key; Illumination Voltage (Nominal): -; Ingress Protection: -; Operating Temperature: -40°C ~ 85°C; SchLibComponentName: KMR211GLFS; Features: Grounding Pin; ComponentLink1URL: kmr2 (pdf, 134.614 KB); Pricing 1: 1=0.51, 10=0.493, 25=0.484, 50=0.4656, 100=0.4017, 250=0.3652, 500=0.34694, 1000=0.2739 (USD); Packaging: Cut Tape (CT)
SW300-SW303 = CMP-02020-04: Pushbutton Switch SPST-NO Keyswitch Through Hole; Manufacturer: Cherry Americas LLC; Manufacturer Part Number: MX1A-E1NW; Supplier 1: Digi-Key; ComponentLink1URL: https://www.mouser.ch/datasheet/2/71/EN_CHERRY_MX_BLUE-1608304.pdf; Supplier Part Number 1: CH197-ND; ComponentLink1Description: Datasheet
TP300-TP307 = CMP-00246-13: Testpoint various footprints
U300 = CMP-02019-01: RISC Microcontroller, 32-Bit, FLASH, CORTEX-M0 CPU, 32MHz; Manufacturer: STMicroelectronics; Supplier 1: Digi-Key; Manufacturer Part Number: STM32L010C6T6; ComponentLink1Description: Datasheet; Supplier Part Number 1: 497-19662-ND; ComponentLink1URL: https://www.st.com/resource/en/datasheet/stm32l010c6.pdf
U301 = CMP-00089-07: SENSIRION         SHT31-DIS-B             Humidity Sensor, 2 %, 3.3 V, 0% to 100% Relative Humidity, TDFN, 8 Pins, 8 s; Accuracy: 2%; Sensor Type: Temperature; Interface: I2C; Response Time: 8s; Min Supply Voltage: 2.4V; Operating Supply Voltage: 3.3V; Max Supply Voltage: 5.5V; Output Type: I2C, Digital; Packaging: Cut Tape; Height: 1mm; ComponentLink1Description: Datasheet; Case/Package: DFN; Number of Pins: 8; Min Operating Temperature: -40°C; Supplier 1: Digi-Key; ComponentLink1URL: https://sensirion.com/media/documents/213E6A3B/63A5A569/Datasheet_SHT3x_DIS.pdf; Manufacturer Part Number: SHT31-DIS-B; Supplier Part Number 1: 1649-1011-1-ND; REACH SVHC: No SVHC; Mount: Surface Mount; Datasheet: https://sensirion.com/media/documents/213E6A3B/63A5A569/Datasheet_SHT3x_DIS.pdf; Manufacturer: Sensirion; Width: 2.6mm; Length: 2.6mm; Max Operating Temperature: 125°C; Lead Free: Lead Free
X300 = CMP-00729-01: 32.768kHz ±20ppm Crystal 6pF 70 kOhms 2-SMD, No Lead; Manufacturer: Abracon LLC; Manufacturer Part Number: ABS07-32.768KHZ-6-T; Supplier Part Number 1: 535-11898-1-ND; Supplier 1: Digi-Key; ComponentLink1Description: Datasheet

## Sheet 05 - Connector.SchDoc
size A4; SheetNumber: 4; SheetTotal: 4; SchemaTitle: Overview
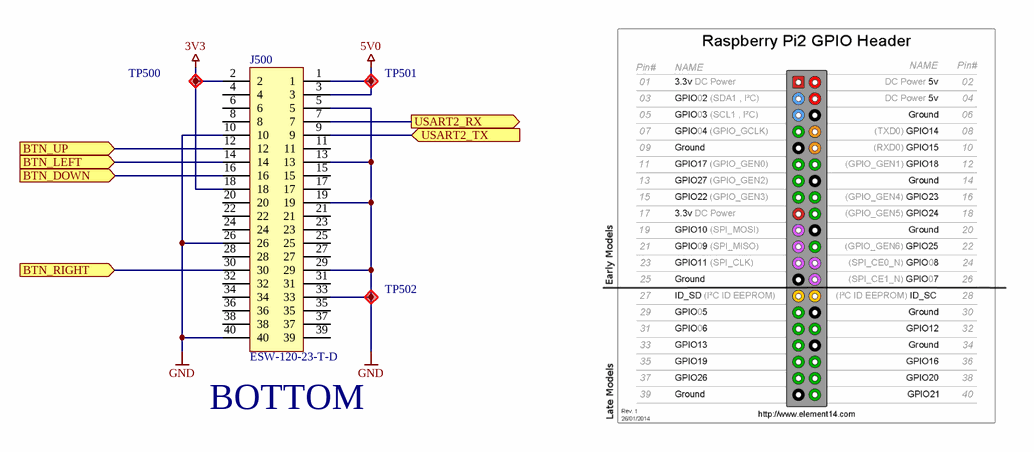
[diagram p3: 05 - Connector.SchDoc]

### Parts
J500  ESW-120-23-T-D  [ESW-120-23-T-D-Footprint-1]
TP500  Testpoint  [Testpoint SMD 1.5mm]  (value not drawn)  (no BOM)
TP501  Testpoint  [Testpoint SMD 1.5mm]  (value not drawn)  (no BOM)
TP502  Testpoint  [Testpoint SMD 1.5mm]  (value not drawn)  (no BOM)

### Ports
BTN_DOWN (in), BTN_LEFT (in), BTN_RIGHT (in), BTN_UP (in), USART2_RX (out), USART2_TX (in)

### Nets
3V3: J500.2 J500.18 TP500.1
5V0: J500.1 J500.3 TP501.1
GND: J500.5 J500.10 J500.13 J500.19 J500.26 J500.29 J500.33 J500.40 TP502.1
BTN_DOWN: J500.16 ; port BTN_DOWN
BTN_LEFT: J500.14 ; port BTN_LEFT
BTN_RIGHT: J500.30 ; port BTN_RIGHT
BTN_UP: J500.12 ; port BTN_UP
USART2_RX: J500.7 ; port USART2_RX
USART2_TX: J500.9 ; port USART2_TX

Not connected (* = marked no-connect by the designer): J500 4 6 8 11 15 17 20 21 22 23 24 25 27 28 31 32 34 35 36 37 38 39

### Notes on the sheet
- (near J500) BOTTOM
- Schema Title:
- Project:
- Revision:
- Author:
- PCB Name:
- Date:
- Time:
- Sheet:
- of
- Doc Name:
- A4

### Library data of the parts
J500 = CMP-02021-01: 40 Position Elevated Socket Connector 0.100" (2.54mm) Through Hole Tin; Manufacturer: Samtec Inc.; Manufacturer Part Number: ESW-120-23-T-D; ComponentLink1Description: Datasheet; ComponentLink1URL: https://suddendocs.samtec.com/prints/esw-1xx-xx-x-x-xx-xx-mkt.pdf; Supplier Part Number 1: 2031-ESW-120-23-T-D-ND; Supplier 1: Digi-Key
TP500-TP502 = CMP-00246-13: Testpoint various footprints

## Nets that join several sheets
3V3: 04 - Display (19 pins), 03 - MCU (20 pins), 05 - Connector (J500.2 J500.18 TP500.1)
GND: 04 - Display (24 pins), 03 - MCU (26 pins), 05 - Connector (9 pins)
#CLR: 04 - Display (7 pins), 03 - MCU (U300.10)
A_HO: 04 - Display (U401.1), 03 - MCU (U300.14)
A_HT: 04 - Display (U400.1), 03 - MCU (U300.11)
A_MO: 04 - Display (U403.1), 03 - MCU (U300.29)
A_MT: 04 - Display (U402.1), 03 - MCU (U300.16)
A_SO: 04 - Display (U405.1), 03 - MCU (U300.33)
A_ST: 04 - Display (U404.1), 03 - MCU (U300.31)
BTN_DOWN: 03 - MCU (R301.1 SW301.1 U300.19), 05 - Connector (J500.16)
BTN_LEFT: 03 - MCU (R302.1 SW302.1 U300.20), 05 - Connector (J500.14)
BTN_RIGHT: 03 - MCU (R303.1 SW303.1 U300.39), 05 - Connector (J500.30)
BTN_UP: 03 - MCU (R300.1 SW300.1 U300.18), 05 - Connector (J500.12)
CLK_A_HO: 04 - Display (U401.8), 03 - MCU (U300.15)
CLK_A_HT: 04 - Display (U400.8), 03 - MCU (U300.12)
CLK_A_MO: 04 - Display (U403.8), 03 - MCU (U300.30)
CLK_A_MT: 04 - Display (U402.8), 03 - MCU (U300.17)
CLK_A_SO: 04 - Display (U405.8), 03 - MCU (U300.38)
CLK_A_ST: 04 - Display (U404.8), 03 - MCU (U300.32)
EN_HO: 04 - Display (Q401.1 R450.1), 03 - MCU (U300.40)
EN_HT: 04 - Display (Q400.1 R449.1), 03 - MCU (U300.13)
EN_MO: 04 - Display (Q403.1 R452.1), 03 - MCU (U300.25)
EN_MT: 04 - Display (Q402.1 R451.1), 03 - MCU (U300.41)
EN_SO: 04 - Display (Q405.1 R454.1), 03 - MCU (U300.27)
EN_ST: 04 - Display (Q404.1 R453.1), 03 - MCU (U300.26)
USART2_RX: 03 - MCU (J301.9 TP305.1 U300.43), 05 - Connector (J500.7)
USART2_TX: 03 - MCU (J301.10 TP304.1 U300.42), 05 - Connector (J500.9)

## Assembly variants
1: all parts fitted